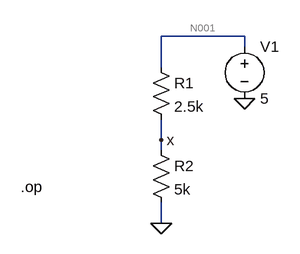
[diagram p0: schematic Draft2.asc]
Draft2.asc, the LTspice schematic file:
Version 4
SHEET 1 880 680
WIRE 336 16 208 16
WIRE 336 32 336 16
WIRE 208 64 208 16
WIRE 208 176 208 144
WIRE 208 192 208 176
WIRE 208 304 208 272
FLAG 336 112 0
FLAG 208 176 x
FLAG 208 304 0
SYMBOL res 192 48 R0
SYMATTR InstName R1
SYMATTR Value 2.5k
SYMBOL res 192 176 R0
SYMATTR InstName R2
SYMATTR Value 5k
SYMBOL voltage 336 16 R0
WINDOW 123 0 0 Left 0
WINDOW 39 0 0 Left 0
SYMATTR InstName V1
SYMATTR Value 5
TEXT -8 248 Left 2 !.op

The netlist it stands for:
* Draft2.asc
R1 N001 x 2.5k
R2 x 0 5k
V1 N001 0 5
.op
.backanno
.end

* Results of the author's LTspice run, read from the files saved beside the schematic
* Operating Point:
*   V(n001) = 5 V
*   V(x) = 3.333 V
*   I(R2) = 666.7 µA
*   I(R1) = 666.7 µA
*   I(V1) = -666.7 µA